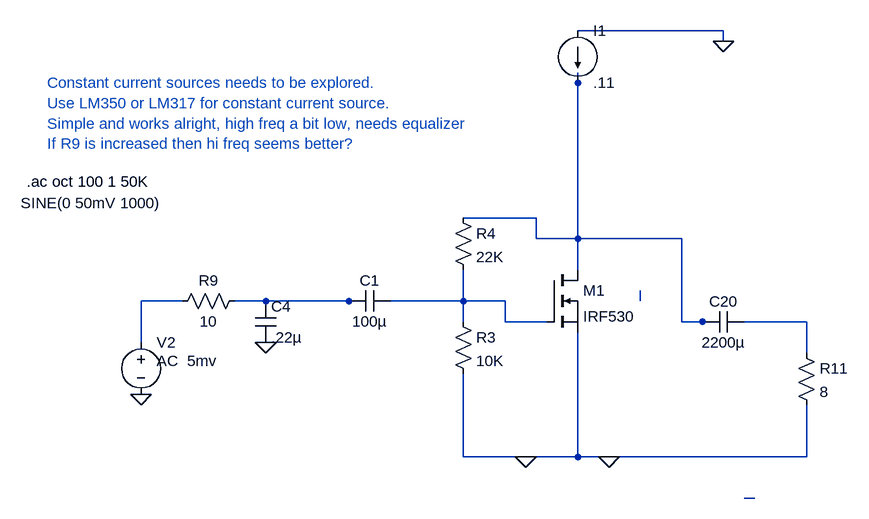
[diagram p0: schematic Pass Zen.asc]
Pass Zen.asc, the LTspice schematic file:
Version 4
SHEET 1 1788 680
WIRE 448 -304 224 -304
WIRE 448 -288 448 -304
WIRE 224 -224 224 -240
WIRE 160 -16 48 -16
WIRE 160 16 160 -16
WIRE 224 16 224 -224
WIRE 224 16 160 16
WIRE 384 16 224 16
WIRE 224 64 224 16
WIRE -384 112 -448 112
WIRE -256 112 -304 112
WIRE -128 112 -256 112
WIRE -112 112 -128 112
WIRE 48 112 48 64
WIRE 48 112 -64 112
WIRE 112 112 48 112
WIRE 320 112 320 96
WIRE 48 144 48 112
WIRE 112 144 112 112
WIRE 176 144 112 144
WIRE 384 144 384 16
WIRE 416 144 384 144
WIRE 432 144 416 144
WIRE 576 144 480 144
WIRE -448 176 -448 112
WIRE 576 192 576 144
WIRE 48 352 48 224
WIRE 144 352 48 352
WIRE 224 352 224 160
WIRE 224 352 144 352
WIRE 272 352 224 352
WIRE 576 352 576 272
WIRE 576 352 272 352
WIRE 496 416 480 416
FLAG 144 352 0
FLAG -448 256 0
FLAG 272 352 0
FLAG -256 176 0
FLAG 448 -288 0
SYMBOL res 32 -32 R0
SYMATTR InstName R4
SYMATTR Value 22K
SYMBOL res 32 128 R0
SYMATTR InstName R3
SYMATTR Value 10K
SYMBOL cap -64 96 R90
WINDOW 0 0 32 VBottom 2
WINDOW 3 32 32 VTop 2
SYMATTR InstName C1
SYMATTR Value 100µ
SYMBOL voltage -448 160 R0
WINDOW 123 24 44 Left 2
WINDOW 39 24 72 Left 2
WINDOW 3 -185 -199 Left 2
SYMATTR Value2 AC  5mv
SYMATTR Value SINE(0 50mV 1000)
SYMATTR InstName V2
SYMBOL res 560 176 R0
SYMATTR InstName R11
SYMATTR Value 8
SYMBOL cap 480 128 R90
WINDOW 0 0 32 VBottom 2
WINDOW 3 32 32 VTop 2
SYMATTR InstName C20
SYMATTR Value 2200µ
SYMBOL res -288 96 R90
WINDOW 0 0 56 VBottom 2
WINDOW 3 32 56 VTop 2
SYMATTR InstName R9
SYMATTR Value 10
SYMBOL cap -272 112 R0
SYMATTR InstName C4
SYMATTR Value .22µ
SYMBOL nmos 176 64 R0
SYMATTR InstName M1
SYMATTR Value IRF530
SYMBOL current 224 -304 R0
WINDOW 123 0 0 Left 2
WINDOW 39 0 0 Left 2
SYMATTR InstName I1
SYMATTR Value .11
TEXT -624 -72 Left 2 !.ac oct 100 1 50K
TEXT -592 -224 Left 2 ;Constant current sources needs to be explored.\nUse LM350 or LM317 for constant current source.\nSimple and works alright, high freq a bit low, needs equalizer\nIf R9 is increased then hi freq seems better?

The netlist it stands for:
* Pass Zen.asc
R4 N001 N004 22K
R3 N004 0 10K
C1 N004 N003 100µ
V2 N002 0 SINE(0 50mV 1000) AC  5mv
R11 N006 0 8
C20 N006 N001 2200µ
R9 N003 N002 10
C4 N003 0 .22µ
M1 N001 N004 0 0 IRF530
I1 0 N001 .11
.model NMOS NMOS
.model PMOS PMOS
.lib standard.mos
.ac oct 100 1 50K
* Constant current sources needs to be explored.
* Use LM350 or LM317 for constant current source.
* Simple and works alright, high freq a bit low, needs equalizer
* If R9 is increased then hi freq seems better?
.backanno
.end